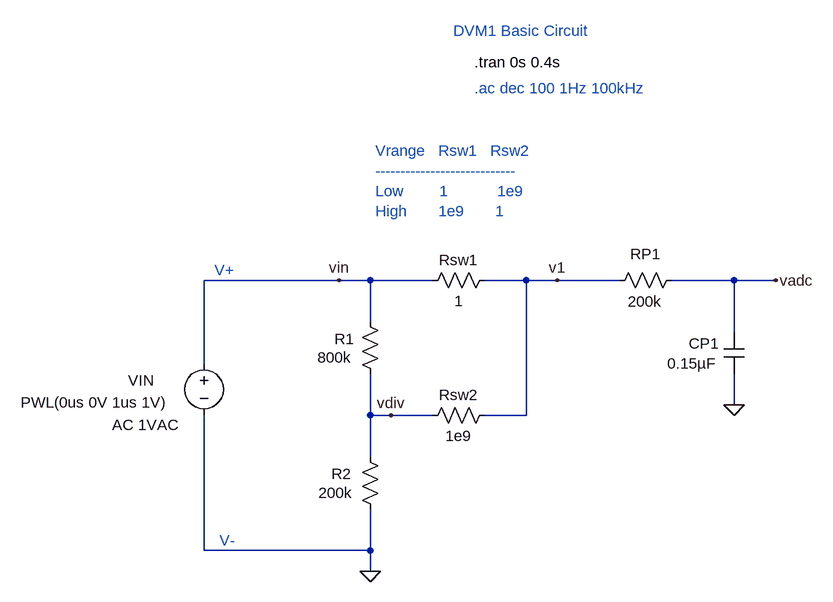
[diagram p0: schematic DVM1_basic1.asc]
DVM1_basic1.asc, the LTspice schematic file:
Version 4
SHEET 1 2560 916
WIRE 784 -256 576 -256
WIRE 832 -256 784 -256
WIRE 928 -256 832 -256
WIRE 1072 -256 1008 -256
WIRE 1120 -256 1072 -256
WIRE 1216 -256 1120 -256
WIRE 1392 -256 1296 -256
WIRE 1456 -256 1392 -256
WIRE 832 -192 832 -256
WIRE 1392 -176 1392 -256
WIRE 576 -128 576 -256
WIRE 1392 -64 1392 -112
WIRE 832 -48 832 -112
WIRE 864 -48 832 -48
WIRE 928 -48 864 -48
WIRE 1072 -48 1072 -256
WIRE 1072 -48 1008 -48
WIRE 832 16 832 -48
WIRE 576 160 576 -48
WIRE 832 160 832 96
WIRE 832 160 576 160
WIRE 832 192 832 160
FLAG 1392 -64 0
FLAG 832 192 0
FLAG 784 -256 vin
FLAG 1120 -256 v1
FLAG 1456 -256 vadc
FLAG 864 -48 vdiv
SYMBOL res 1312 -272 R90
WINDOW 0 -9 56 VBottom 2
WINDOW 3 64 57 VBottom 2
SYMATTR InstName RP1
SYMATTR Value 200k
SYMBOL cap 1376 -176 R0
WINDOW 0 -54 17 Left 2
WINDOW 3 -87 48 Left 2
SYMATTR InstName CP1
SYMATTR Value 0.15µF
SYMBOL res 816 -208 R0
WINDOW 0 -39 42 Left 2
WINDOW 3 -65 71 Left 2
SYMATTR InstName R1
SYMATTR Value 800k
SYMBOL res 816 0 R0
WINDOW 0 -44 42 Left 2
WINDOW 3 -64 71 Left 2
SYMATTR InstName R2
SYMATTR Value 200k
SYMBOL voltage 576 -144 R0
WINDOW 0 -117 42 Left 2
WINDOW 3 -282 76 Left 2
WINDOW 123 -141 111 Left 2
WINDOW 39 0 0 Left 0
SYMATTR InstName VIN
SYMATTR Value PWL(0us 0V 1us 1V)
SYMATTR Value2 AC 1VAC
SYMBOL res 1024 -272 R90
WINDOW 0 0 56 VBottom 2
WINDOW 3 32 56 VTop 2
SYMATTR InstName Rsw1
SYMATTR Value 1
SYMBOL res 1024 -64 R90
WINDOW 0 0 56 VBottom 2
WINDOW 3 32 56 VTop 2
SYMATTR InstName Rsw2
SYMATTR Value 1e9
TEXT 960 -640 Left 2 ;DVM1 Basic Circuit
TEXT 592 -272 Left 2 ;V+
TEXT 600 144 Left 2 ;V-
TEXT 992 -592 Left 2 !.tran 0s 0.4s
TEXT 840 -456 Left 2 ;Vrange   Rsw1   Rsw2\n----------------------------\nLow        1           1e9\nHigh       1e9       1
TEXT 992 -552 Left 2 ;.ac dec 100 1Hz 100kHz

The netlist it stands for:
* DVM1_basic1.asc
RP1 vadc v1 200k
CP1 vadc 0 0.15µF
R1 vin vdiv 800k
R2 vdiv 0 200k
VIN vin 0 PWL(0us 0V 1us 1V) AC 1VAC
Rsw1 v1 vin 1
Rsw2 v1 vdiv 1e9
* DVM1 Basic Circuit
* V+
* V-
.tran 0s 0.4s
* Vrange   Rsw1   Rsw2
* ----------------------------
* Low        1           1e9
* High       1e9       1
* .ac dec 100 1Hz 100kHz
.backanno
.end